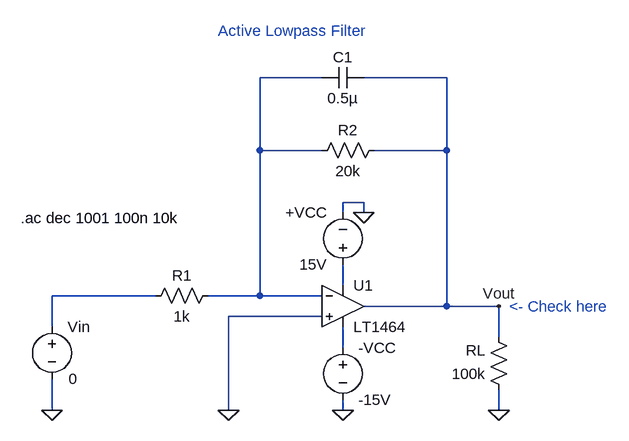
[diagram p0: schematic HLab03_active_lowpass.asc]
HLab03_active_lowpass.asc, the LTspice schematic file:
Version 4
SHEET 1 880 680
WIRE 400 -64 304 -64
WIRE 592 -64 464 -64
WIRE 304 48 304 -64
WIRE 400 48 304 48
WIRE 592 48 592 -64
WIRE 592 48 480 48
WIRE 464 128 432 128
WIRE 432 144 432 128
WIRE 464 144 464 128
WIRE 432 256 432 224
WIRE 144 272 -16 272
WIRE 304 272 304 48
WIRE 304 272 224 272
WIRE 400 272 304 272
WIRE 592 288 592 48
WIRE 592 288 464 288
WIRE 672 288 592 288
WIRE 400 304 256 304
WIRE -16 320 -16 272
WIRE 672 336 672 288
WIRE 432 352 432 320
WIRE -16 448 -16 400
WIRE 256 448 256 304
WIRE 432 448 432 432
WIRE 672 448 672 416
FLAG 464 144 0
FLAG 432 448 0
FLAG -16 448 0
FLAG 256 448 0
FLAG 672 448 0
FLAG 672 288 Vout
SYMBOL Opamps/LT1464 432 224 R0
SYMATTR InstName U1
SYMBOL voltage -16 304 R0
WINDOW 3 26 96 Left 2
SYMATTR Value 0
SYMATTR InstName Vin
SYMATTR Value2 AC 1
SYMBOL voltage 432 240 R180
WINDOW 0 24 96 Left 2
WINDOW 3 24 16 Left 2
SYMATTR InstName +VCC
SYMATTR Value 15V
SYMBOL voltage 432 336 R0
SYMATTR InstName -VCC
SYMATTR Value -15V
SYMBOL res 240 256 R90
WINDOW 0 0 56 VBottom 2
WINDOW 3 32 56 VTop 2
SYMATTR InstName R1
SYMATTR Value 1k
SYMBOL res 496 32 R90
WINDOW 0 0 56 VBottom 2
WINDOW 3 32 56 VTop 2
SYMATTR InstName R2
SYMATTR Value 20k
SYMBOL res 688 432 R180
WINDOW 0 36 76 Left 2
WINDOW 3 36 40 Left 2
SYMATTR InstName RL
SYMATTR Value 100k
SYMBOL cap 464 -80 R90
WINDOW 0 0 32 VBottom 2
WINDOW 3 32 32 VTop 2
SYMATTR InstName C1
SYMATTR Value 0.5µ
TEXT -64 152 Left 2 !.ac dec 1001 100n 10k
TEXT 688 288 Left 2 ;<- Check here
TEXT 240 -136 Left 2 ;Active Lowpass Filter

The netlist it stands for:
* HLab03_active_lowpass.asc
XU1 0 N001 N002 N004 Vout LT1464  ; pins In+ In- V+ V- OUT
Vin N003 0 0 AC 1
V§+VCC N002 0 15V
V§-VCC N004 0 -15V
R1 N001 N003 1k
R2 Vout N001 20k
RL 0 Vout 100k
C1 Vout N001 0.5µ
.ac dec 1001 100n 10k
* <- Check here
* Active Lowpass Filter
.backanno
.end